# Altium schematic sheet ATmega16_DIP.SchDoc
size 129 x 88 mm
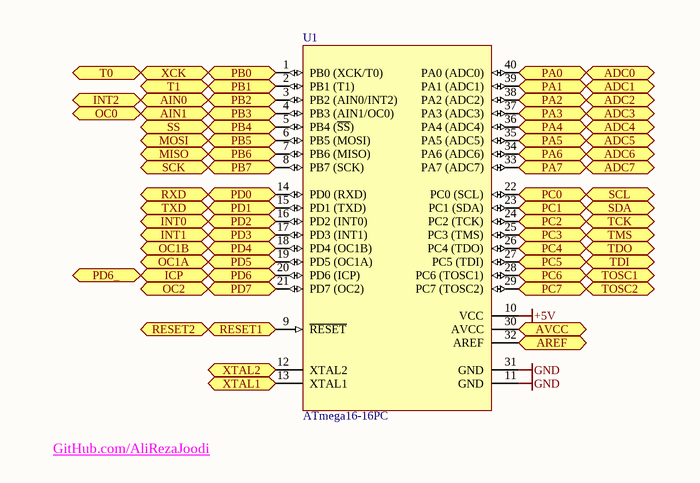
[diagram p0: ATmega16_DIP.SchDoc]

## Parts
U1  ATmega16-16PC  [40P6]

## Ports
ADC0 (in), ADC1 (in), ADC2 (in), ADC3 (in), ADC4 (in), ADC5 (in), ADC6 (in), ADC7 (in), AIN0 (bidir), AIN1 (bidir), AREF (in), AVCC (in), ICP (bidir), INT0 (in), INT1 (in), INT2 (in), MISO (bidir), MOSI (bidir), OC0 (bidir), OC1A (out), OC1B (out), OC2 (bidir), PA0 (bidir), PA1 (bidir), PA2 (bidir), PA3 (bidir), PA4 (bidir), PA5 (bidir), PA6 (bidir), PA7 (bidir), PB0, PB1, PB2, PB3, PB4, PB5, PB6, PB7, PC0 (bidir), PC1 (bidir), PC2 (bidir), PC3 (bidir), PC4 (bidir), PC5 (bidir), PC6 (bidir), PC7 (bidir), PD0, PD1, PD2, PD3, PD4, PD5, PD6, PD6_, PD7, RESET1 (in), RESET2 (in), RXD (bidir), SCK (bidir), SCL (bidir), SDA (bidir), SS (bidir), T0 (bidir), T1 (bidir), TCK (bidir), TDI (bidir), TDO (bidir), TMS (bidir), TOSC1 (bidir), TOSC2 (bidir), TXD (bidir), XCK (bidir), XTAL1 (in), XTAL2 (in)

## Nets
+5V: U1.10(VCC)
GND: U1.11(GND) U1.31(GND)
ADC0: U1.40(PA0_(ADC0)) ; port PA0, port ADC0
ADC1: U1.39(PA1_(ADC1)) ; port PA1, port ADC1
ADC2: U1.38(PA2_(ADC2)) ; port PA2, port ADC2
ADC3: U1.37(PA3_(ADC3)) ; port PA3, port ADC3
ADC4: U1.36(PA4_(ADC4)) ; port PA4, port ADC4
ADC5: U1.35(PA5_(ADC5)) ; port PA5, port ADC5
ADC6: U1.34(PA6_(ADC6)) ; port PA6, port ADC6
ADC7: U1.33(PA7_(ADC7)) ; port PA7, port ADC7
AIN0: U1.3(PB2_(AIN0/INT2)) ; port PB2, port AIN0, port INT2
AIN1: U1.4(PB3_(AIN1/OC0)) ; port AIN1, port PB3, port OC0
AREF: U1.32(AREF) ; port AREF
AVCC: U1.30(AVCC) ; port AVCC
ICP: U1.20(PD6_(ICP)) ; port ICP, port PD6, port PD6_
INT0: U1.16(PD2_(INT0)) ; port PD2, port INT0
INT1: U1.17(PD3_(INT1)) ; port INT1, port PD3
MISO: U1.7(PB6_(MISO)) ; port MISO, port PB6
MOSI: U1.6(PB5_(MOSI)) ; port PB5, port MOSI
OC1A: U1.19(PD5_(OC1A)) ; port PD5, port OC1A
OC1B: U1.18(PD4_(OC1B)) ; port OC1B, port PD4
OC2: U1.21(PD7_(OC2)) ; port OC2, port PD7
PB0: U1.1(PB0_(XCK/T0)) ; port XCK, port PB0, port T0
PB1: U1.2(PB1_(T1)) ; port T1, port PB1
PB4: U1.5(PB4_(~{SS})) ; port SS, port PB4
PB7: U1.8(PB7_(SCK)) ; port SCK, port PB7
PC0: U1.22(PC0_(SCL)) ; port PC0, port SCL
PC1: U1.23(PC1_(SDA)) ; port PC1, port SDA
PC2: U1.24(PC2_(TCK)) ; port PC2, port TCK
PC3: U1.25(PC3_(TMS)) ; port PC3, port TMS
PC4: U1.26(PC4_(TDO)) ; port PC4, port TDO
PC5: U1.27(PC5_(TDI)) ; port PC5, port TDI
PC6: U1.28(PC6_(TOSC1)) ; port PC6, port TOSC1
PC7: U1.29(PC7_(TOSC2)) ; port PC7, port TOSC2
PD0: U1.14(PD0_(RXD)) ; port RXD, port PD0
PD1: U1.15(PD1_(TXD)) ; port TXD, port PD1
RESET1: U1.9(~{RESET}) ; port RESET1, port RESET2
XTAL1: U1.13(XTAL1) ; port XTAL1
XTAL2: U1.12(XTAL2) ; port XTAL2

## Notes on the sheet
- GitHub.com/AliRezaJoodi

## Library data of the parts
U1 = ATmega16-16PC: 8-Bit AVR Microcontroller with 16K Bytes of In-System Programmable Flash Memory; Published: 17-Sep-2003; DatasheetVersion: 2466E-AVR-10/02; PackageVersion: revB, Sep-2001; PackageReference: 40P6; Publisher: Altium Limited; PackageDescription: 40-lead (0.600"/15.24mm Wide) Plastic Dual Inline Package (PDIP); Supplier 1: Digi-Key; Supplier Part Number 1: ATMEGA16-16PC-ND; Supplier 2: Mouser; Supplier Part Number 2: 556-ATMEGA16-16PC; Code_JEDEC: MS-011-AC; ComponentLink1Description: Datasheet; ComponentLink1URL: http://www.atmel.com/dyn/resources/prod_documents/doc2466.pdf; ComponentLink2Description: Atmel.com Home; ComponentLink2URL: http://www.atmel.com